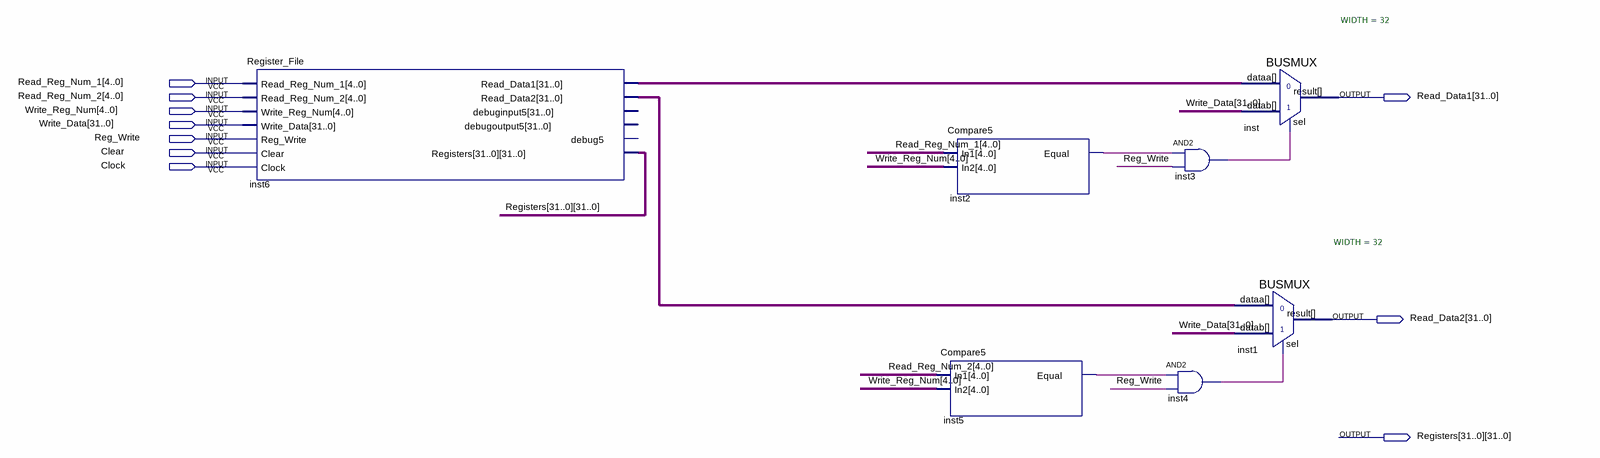
[diagram p0: schematic sheet]
// Quartus schematic Transparent_Register_File.bdf as structural Verilog: 7 symbols, 10 pins
module Transparent_Register_File (
  input  [4:0] Read_Reg_Num_1,
  input  [4:0] Read_Reg_Num_2,
  input  [4:0] Write_Reg_Num,
  input  [31:0] Write_Data,
  input  Reg_Write,
  input  Clear,
  input  Clock,
  output [31:0] Read_Data1,
  output [31:0] Read_Data2,
  output [31:0] Registers_31,
  output [31:0] Registers_30,
  output [31:0] Registers_29,
  output [31:0] Registers_28,
  output [31:0] Registers_27,
  output [31:0] Registers_26,
  output [31:0] Registers_25,
  output [31:0] Registers_24,
  output [31:0] Registers_23,
  output [31:0] Registers_22,
  output [31:0] Registers_21,
  output [31:0] Registers_20,
  output [31:0] Registers_19,
  output [31:0] Registers_18,
  output [31:0] Registers_17,
  output [31:0] Registers_16,
  output [31:0] Registers_15,
  output [31:0] Registers_14,
  output [31:0] Registers_13,
  output [31:0] Registers_12,
  output [31:0] Registers_11,
  output [31:0] Registers_10,
  output [31:0] Registers_9,
  output [31:0] Registers_8,
  output [31:0] Registers_7,
  output [31:0] Registers_6,
  output [31:0] Registers_5,
  output [31:0] Registers_4,
  output [31:0] Registers_3,
  output [31:0] Registers_2,
  output [31:0] Registers_1,
  output [31:0] Registers_0
);

  wire inst2_equal, inst3_out, inst4_out, inst5_equal;
  wire [31:0] inst6_read_data1, inst6_read_data2;

  Register_File inst6 (
    .Read_Reg_Num_1(Read_Reg_Num_1), .Read_Reg_Num_2(Read_Reg_Num_2), .Write_Reg_Num(Write_Reg_Num),
    .Write_Data(Write_Data), .Reg_Write(Reg_Write), .Clear(Clear), .Clock(Clock),
    .Read_Data1(inst6_read_data1), .Read_Data2(inst6_read_data2),
    .Registers({Registers_31, Registers_30, Registers_29, Registers_28, Registers_27, Registers_26, Registers_25, Registers_24, Registers_23, Registers_22, Registers_21, Registers_20, Registers_19, Registers_18, Registers_17, Registers_16, Registers_15, Registers_14, Registers_13, Registers_12, Registers_11, Registers_10, Registers_9, Registers_8, Registers_7, Registers_6, Registers_5, Registers_4, Registers_3, Registers_2, Registers_1, Registers_0}));  // open: debuginput5, debugoutput5, debug5
  Compare5 inst2 (.In1(Read_Reg_Num_1), .In2(Write_Reg_Num), .Equal(inst2_equal));
  Compare5 inst5 (.In1(Read_Reg_Num_2), .In2(Write_Reg_Num), .Equal(inst5_equal));
  and inst3 (inst3_out, inst2_equal, Reg_Write);
  and inst4 (inst4_out, inst5_equal, Reg_Write);
  BUSMUX #(.WIDTH(32)) inst (.datab(Write_Data), .sel(inst3_out), .dataa(inst6_read_data1), .result(Read_Data1));
  BUSMUX #(.WIDTH(32)) inst1 (.datab(Write_Data), .sel(inst4_out), .dataa(inst6_read_data2), .result(Read_Data2));
endmodule
